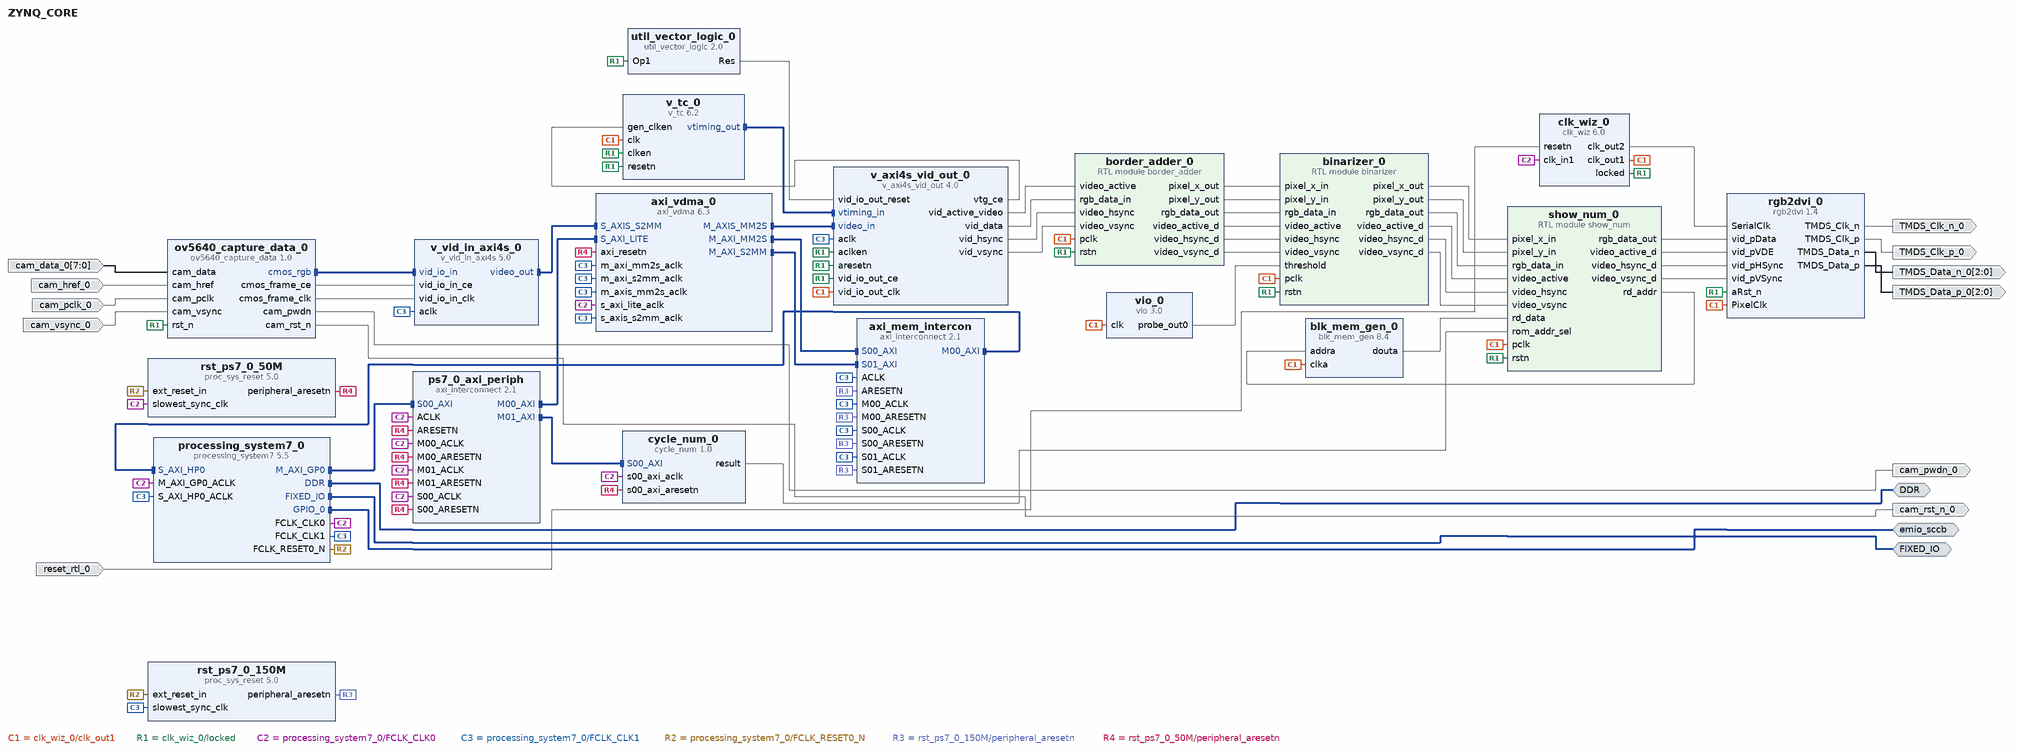
[diagram p0: block diagram of the top level]
# Vivado block design ZYNQ_CORE, xc7z020clg484-1, Vivado 2023.1
create_bd_design ZYNQ_CORE

create_bd_intf_port -mode Master -vlnv xilinx.com:interface:ddrx_rtl:1.0 DDR
create_bd_intf_port -mode Master -vlnv xilinx.com:display_processing_system7:fixedio_rtl:1.0 FIXED_IO
create_bd_intf_port -mode Master -vlnv xilinx.com:interface:gpio_rtl:1.0 emio_sccb
create_bd_port -dir I -type rst reset_rtl_0
set_property -dict {CONFIG.POLARITY ACTIVE_LOW} [get_bd_ports reset_rtl_0]
create_bd_port -dir O -type clk TMDS_Clk_p_0
create_bd_port -dir O -type clk TMDS_Clk_n_0
create_bd_port -dir O -from 2 -to 0 TMDS_Data_p_0
create_bd_port -dir O -from 2 -to 0 TMDS_Data_n_0
create_bd_port -dir I -from 7 -to 0 cam_data_0
create_bd_port -dir I cam_href_0
create_bd_port -dir I cam_vsync_0
create_bd_port -dir I cam_pclk_0
create_bd_port -dir O -type rst cam_rst_n_0
create_bd_port -dir O cam_pwdn_0

create_bd_cell -type ip -vlnv xilinx.com:ip:processing_system7:5.5 processing_system7_0
set_property -dict [list \
  CONFIG.PCW_EN_CLK1_PORT 1 \
  CONFIG.PCW_FCLK_CLK1_BUF TRUE \
  CONFIG.PCW_FPGA1_PERIPHERAL_FREQMHZ 150 \
  CONFIG.PCW_FPGA_FCLK1_ENABLE 1 \
  CONFIG.PCW_GPIO_EMIO_GPIO_ENABLE 1 \
  CONFIG.PCW_GPIO_EMIO_GPIO_IO 2 \
  CONFIG.PCW_GPIO_EMIO_GPIO_WIDTH 2 \
  CONFIG.PCW_SD0_GRP_CD_ENABLE 0 \
  CONFIG.PCW_SD0_GRP_WP_ENABLE 0 \
  CONFIG.PCW_SD0_PERIPHERAL_ENABLE 1 \
  CONFIG.PCW_SD0_SD0_IO {MIO 40 .. 45} \
  CONFIG.PCW_SDIO_PERIPHERAL_FREQMHZ 100 \
  CONFIG.PCW_UIPARAM_DDR_BUS_WIDTH {16 Bit} \
  CONFIG.PCW_UIPARAM_DDR_PARTNO {MT41K256M16 RE-125} \
  CONFIG.PCW_USE_S_AXI_HP0 1 \
] [get_bd_cells processing_system7_0]
# 55 more settings of processing_system7_0 are not shown: defaults, MIO pin electricals, DDR timing, and values the tool derives
create_bd_cell -type ip -vlnv xilinx.com:ip:axi_vdma:6.3 axi_vdma_0
set_property -dict [list \
  CONFIG.c_m_axis_mm2s_tdata_width 24 \
  CONFIG.c_mm2s_linebuffer_depth 2048 \
  CONFIG.c_mm2s_max_burst_length 64 \
  CONFIG.c_s2mm_linebuffer_depth 2048 \
  CONFIG.c_s2mm_max_burst_length 64 \
] [get_bd_cells axi_vdma_0]
create_bd_cell -type ip -vlnv xilinx.com:ip:v_axi4s_vid_out:4.0 v_axi4s_vid_out_0
set_property -dict {CONFIG.C_HAS_ASYNC_CLK 1} [get_bd_cells v_axi4s_vid_out_0]
create_bd_cell -type ip -vlnv xilinx.com:ip:v_tc:6.2 v_tc_0
set_property -dict {CONFIG.HAS_AXI4_LITE false CONFIG.VIDEO_MODE 720p CONFIG.enable_detection false} [get_bd_cells v_tc_0]
create_bd_cell -type ip -vlnv xilinx.com:ip:clk_wiz:6.0 clk_wiz_0
set_property -dict [list \
  CONFIG.CLKIN1_JITTER_PS 200.0 \
  CONFIG.CLKOUT1_JITTER 155.608 \
  CONFIG.CLKOUT1_PHASE_ERROR 158.235 \
  CONFIG.CLKOUT1_REQUESTED_OUT_FREQ 75 \
  CONFIG.CLKOUT2_JITTER 117.790 \
  CONFIG.CLKOUT2_PHASE_ERROR 158.235 \
  CONFIG.CLKOUT2_REQUESTED_OUT_FREQ 375 \
  CONFIG.CLKOUT2_USED true \
  CONFIG.MMCM_CLKFBOUT_MULT_F 22.500 \
  CONFIG.MMCM_CLKIN1_PERIOD 20.000 \
  CONFIG.MMCM_CLKIN2_PERIOD 10.0 \
  CONFIG.MMCM_CLKOUT0_DIVIDE_F 15.000 \
  CONFIG.MMCM_CLKOUT1_DIVIDE 3 \
  CONFIG.NUM_OUT_CLKS 2 \
  CONFIG.PRIM_IN_FREQ 50 \
  CONFIG.RESET_PORT resetn \
  CONFIG.RESET_TYPE ACTIVE_LOW \
] [get_bd_cells clk_wiz_0]
create_bd_cell -type ip -vlnv xilinx.com:ip:axi_interconnect:2.1 ps7_0_axi_periph
set_property -dict {CONFIG.NUM_MI 2} [get_bd_cells ps7_0_axi_periph]
create_bd_cell -type ip -vlnv xilinx.com:ip:proc_sys_reset:5.0 rst_ps7_0_50M
create_bd_cell -type ip -vlnv xilinx.com:ip:axi_interconnect:2.1 axi_mem_intercon
set_property -dict {CONFIG.NUM_MI 1 CONFIG.NUM_SI 2} [get_bd_cells axi_mem_intercon]
create_bd_cell -type ip -vlnv xilinx.com:ip:proc_sys_reset:5.0 rst_ps7_0_150M
create_bd_cell -type ip -vlnv xilinx.com:ip:util_vector_logic:2.0 util_vector_logic_0
set_property -dict {CONFIG.C_OPERATION not CONFIG.C_SIZE 1} [get_bd_cells util_vector_logic_0]
create_bd_cell -type ip -vlnv digilentinc.com:ip:rgb2dvi:1.4 rgb2dvi_0
set_property -dict {CONFIG.kGenerateSerialClk false CONFIG.kRstActiveHigh false} [get_bd_cells rgb2dvi_0]
create_bd_cell -type ip -vlnv xilinx.com:ip:v_vid_in_axi4s:5.0 v_vid_in_axi4s_0
set_property -dict {CONFIG.C_HAS_ASYNC_CLK 1} [get_bd_cells v_vid_in_axi4s_0]
create_bd_cell -type ip -vlnv alientek.com:user:ov5640_capture_data:1.0 ov5640_capture_data_0
create_bd_cell -type ip -vlnv xilinx.com:ip:blk_mem_gen:8.4 blk_mem_gen_0
set_property -dict [list \
  CONFIG.Coe_File ../../../../../../../OV5640_HDMI_ROM_READ_0to9/coe/number.coe \
  CONFIG.Enable_A Always_Enabled \
  CONFIG.Load_Init_File true \
  CONFIG.Memory_Type Single_Port_ROM \
  CONFIG.Register_PortA_Output_of_Memory_Primitives false \
  CONFIG.Write_Depth_A 100000 \
  CONFIG.Write_Width_A 1 \
  CONFIG.use_bram_block Stand_Alone \
] [get_bd_cells blk_mem_gen_0]
create_bd_cell -type module -reference show_num show_num_0
create_bd_cell -type ip -vlnv xilinx.com:user:cycle_num:1.0 cycle_num_0
create_bd_cell -type module -reference border_adder border_adder_0
create_bd_cell -type module -reference binarizer binarizer_0
create_bd_cell -type ip -vlnv xilinx.com:ip:vio:3.0 vio_0
set_property -dict {CONFIG.C_NUM_PROBE_IN 0 CONFIG.C_PROBE_OUT0_INIT_VAL 0x7f CONFIG.C_PROBE_OUT0_WIDTH 8} [get_bd_cells vio_0]

# ---- connections ----

connect_bd_intf_net [get_bd_intf_pins axi_mem_intercon/M00_AXI] [get_bd_intf_pins processing_system7_0/S_AXI_HP0]
connect_bd_intf_net [get_bd_intf_pins axi_vdma_0/M_AXIS_MM2S] [get_bd_intf_pins v_axi4s_vid_out_0/video_in]
connect_bd_intf_net [get_bd_intf_pins axi_vdma_0/M_AXI_MM2S] [get_bd_intf_pins axi_mem_intercon/S00_AXI]
connect_bd_intf_net [get_bd_intf_pins axi_vdma_0/M_AXI_S2MM] [get_bd_intf_pins axi_mem_intercon/S01_AXI]
connect_bd_intf_net [get_bd_intf_pins ov5640_capture_data_0/cmos_rgb] [get_bd_intf_pins v_vid_in_axi4s_0/vid_io_in]
connect_bd_intf_net [get_bd_intf_ports DDR] [get_bd_intf_pins processing_system7_0/DDR]
connect_bd_intf_net [get_bd_intf_ports FIXED_IO] [get_bd_intf_pins processing_system7_0/FIXED_IO]
connect_bd_intf_net [get_bd_intf_ports emio_sccb] [get_bd_intf_pins processing_system7_0/GPIO_0]
connect_bd_intf_net [get_bd_intf_pins processing_system7_0/M_AXI_GP0] [get_bd_intf_pins ps7_0_axi_periph/S00_AXI]
connect_bd_intf_net [get_bd_intf_pins ps7_0_axi_periph/M00_AXI] [get_bd_intf_pins axi_vdma_0/S_AXI_LITE]
connect_bd_intf_net [get_bd_intf_pins ps7_0_axi_periph/M01_AXI] [get_bd_intf_pins cycle_num_0/S00_AXI]
connect_bd_intf_net [get_bd_intf_pins v_tc_0/vtiming_out] [get_bd_intf_pins v_axi4s_vid_out_0/vtiming_in]
connect_bd_intf_net [get_bd_intf_pins v_vid_in_axi4s_0/video_out] [get_bd_intf_pins axi_vdma_0/S_AXIS_S2MM]
connect_bd_net [get_bd_pins binarizer_0/pixel_x_out] [get_bd_pins show_num_0/pixel_x_in]
connect_bd_net [get_bd_pins binarizer_0/pixel_y_out] [get_bd_pins show_num_0/pixel_y_in]
connect_bd_net [get_bd_pins binarizer_0/rgb_data_out] [get_bd_pins show_num_0/rgb_data_in]
connect_bd_net [get_bd_pins binarizer_0/video_active_d] [get_bd_pins show_num_0/video_active]
connect_bd_net [get_bd_pins binarizer_0/video_hsync_d] [get_bd_pins show_num_0/video_hsync]
connect_bd_net [get_bd_pins binarizer_0/video_vsync_d] [get_bd_pins show_num_0/video_vsync]
connect_bd_net [get_bd_pins blk_mem_gen_0/douta] [get_bd_pins show_num_0/rd_data]
connect_bd_net [get_bd_pins border_adder_0/pixel_x_out] [get_bd_pins binarizer_0/pixel_x_in]
connect_bd_net [get_bd_pins border_adder_0/pixel_y_out] [get_bd_pins binarizer_0/pixel_y_in]
connect_bd_net [get_bd_pins border_adder_0/rgb_data_out] [get_bd_pins binarizer_0/rgb_data_in]
connect_bd_net [get_bd_pins border_adder_0/video_active_d] [get_bd_pins binarizer_0/video_active]
connect_bd_net [get_bd_pins border_adder_0/video_hsync_d] [get_bd_pins binarizer_0/video_hsync]
connect_bd_net [get_bd_pins border_adder_0/video_vsync_d] [get_bd_pins binarizer_0/video_vsync]
connect_bd_net -net cam_data_0_1 [get_bd_ports cam_data_0] [get_bd_pins ov5640_capture_data_0/cam_data]
connect_bd_net -net cam_href_0_1 [get_bd_ports cam_href_0] [get_bd_pins ov5640_capture_data_0/cam_href]
connect_bd_net -net cam_pclk_0_1 [get_bd_ports cam_pclk_0] [get_bd_pins ov5640_capture_data_0/cam_pclk]
connect_bd_net -net cam_vsync_0_1 [get_bd_ports cam_vsync_0] [get_bd_pins ov5640_capture_data_0/cam_vsync]
connect_bd_net [get_bd_pins clk_wiz_0/clk_out1] \
  [get_bd_pins v_tc_0/clk] [get_bd_pins v_axi4s_vid_out_0/vid_io_out_clk] [get_bd_pins rgb2dvi_0/PixelClk] \
  [get_bd_pins blk_mem_gen_0/clka] [get_bd_pins show_num_0/pclk] [get_bd_pins border_adder_0/pclk] \
  [get_bd_pins binarizer_0/pclk] [get_bd_pins vio_0/clk]
connect_bd_net [get_bd_pins clk_wiz_0/clk_out2] [get_bd_pins rgb2dvi_0/SerialClk]
connect_bd_net [get_bd_pins clk_wiz_0/locked] \
  [get_bd_pins v_tc_0/clken] [get_bd_pins v_tc_0/resetn] [get_bd_pins v_axi4s_vid_out_0/vid_io_out_ce] \
  [get_bd_pins v_axi4s_vid_out_0/aresetn] [get_bd_pins v_axi4s_vid_out_0/aclken] [get_bd_pins util_vector_logic_0/Op1] \
  [get_bd_pins rgb2dvi_0/aRst_n] [get_bd_pins ov5640_capture_data_0/rst_n] [get_bd_pins show_num_0/rstn] \
  [get_bd_pins border_adder_0/rstn] [get_bd_pins binarizer_0/rstn]
connect_bd_net [get_bd_pins cycle_num_0/result] [get_bd_pins show_num_0/rom_addr_sel]
connect_bd_net [get_bd_pins ov5640_capture_data_0/cam_pwdn] [get_bd_ports cam_pwdn_0]
connect_bd_net [get_bd_pins ov5640_capture_data_0/cam_rst_n] [get_bd_ports cam_rst_n_0]
connect_bd_net [get_bd_pins ov5640_capture_data_0/cmos_frame_ce] [get_bd_pins v_vid_in_axi4s_0/vid_io_in_ce]
connect_bd_net [get_bd_pins ov5640_capture_data_0/cmos_frame_clk] [get_bd_pins v_vid_in_axi4s_0/vid_io_in_clk]
connect_bd_net [get_bd_pins processing_system7_0/FCLK_CLK0] \
  [get_bd_pins clk_wiz_0/clk_in1] [get_bd_pins processing_system7_0/M_AXI_GP0_ACLK] [get_bd_pins axi_vdma_0/s_axi_lite_aclk] \
  [get_bd_pins ps7_0_axi_periph/ACLK] [get_bd_pins ps7_0_axi_periph/S00_ACLK] [get_bd_pins rst_ps7_0_50M/slowest_sync_clk] \
  [get_bd_pins ps7_0_axi_periph/M00_ACLK] [get_bd_pins cycle_num_0/s00_axi_aclk] [get_bd_pins ps7_0_axi_periph/M01_ACLK]
connect_bd_net [get_bd_pins processing_system7_0/FCLK_CLK1] \
  [get_bd_pins processing_system7_0/S_AXI_HP0_ACLK] [get_bd_pins axi_vdma_0/m_axi_mm2s_aclk] \
  [get_bd_pins axi_vdma_0/s_axis_s2mm_aclk] [get_bd_pins axi_vdma_0/m_axis_mm2s_aclk] \
  [get_bd_pins axi_vdma_0/m_axi_s2mm_aclk] [get_bd_pins v_axi4s_vid_out_0/aclk] [get_bd_pins axi_mem_intercon/ACLK] \
  [get_bd_pins axi_mem_intercon/S00_ACLK] [get_bd_pins rst_ps7_0_150M/slowest_sync_clk] \
  [get_bd_pins axi_mem_intercon/M00_ACLK] [get_bd_pins axi_mem_intercon/S01_ACLK] [get_bd_pins v_vid_in_axi4s_0/aclk]
connect_bd_net [get_bd_pins processing_system7_0/FCLK_RESET0_N] [get_bd_pins rst_ps7_0_50M/ext_reset_in] [get_bd_pins rst_ps7_0_150M/ext_reset_in]
connect_bd_net -net reset_rtl_0_1 [get_bd_ports reset_rtl_0] [get_bd_pins clk_wiz_0/resetn]
connect_bd_net [get_bd_pins rgb2dvi_0/TMDS_Clk_n] [get_bd_ports TMDS_Clk_n_0]
connect_bd_net [get_bd_pins rgb2dvi_0/TMDS_Clk_p] [get_bd_ports TMDS_Clk_p_0]
connect_bd_net [get_bd_pins rgb2dvi_0/TMDS_Data_n] [get_bd_ports TMDS_Data_n_0]
connect_bd_net [get_bd_pins rgb2dvi_0/TMDS_Data_p] [get_bd_ports TMDS_Data_p_0]
connect_bd_net [get_bd_pins rst_ps7_0_150M/peripheral_aresetn] \
  [get_bd_pins axi_mem_intercon/S00_ARESETN] [get_bd_pins axi_mem_intercon/M00_ARESETN] \
  [get_bd_pins axi_mem_intercon/ARESETN] [get_bd_pins axi_mem_intercon/S01_ARESETN]
connect_bd_net [get_bd_pins rst_ps7_0_50M/peripheral_aresetn] \
  [get_bd_pins ps7_0_axi_periph/S00_ARESETN] [get_bd_pins axi_vdma_0/axi_resetn] [get_bd_pins ps7_0_axi_periph/M00_ARESETN] \
  [get_bd_pins ps7_0_axi_periph/ARESETN] [get_bd_pins cycle_num_0/s00_axi_aresetn] [get_bd_pins ps7_0_axi_periph/M01_ARESETN]
connect_bd_net [get_bd_pins show_num_0/rd_addr] [get_bd_pins blk_mem_gen_0/addra]
connect_bd_net [get_bd_pins show_num_0/rgb_data_out] [get_bd_pins rgb2dvi_0/vid_pData]
connect_bd_net [get_bd_pins show_num_0/video_active_d] [get_bd_pins rgb2dvi_0/vid_pVDE]
connect_bd_net [get_bd_pins show_num_0/video_hsync_d] [get_bd_pins rgb2dvi_0/vid_pHSync]
connect_bd_net [get_bd_pins show_num_0/video_vsync_d] [get_bd_pins rgb2dvi_0/vid_pVSync]
connect_bd_net [get_bd_pins util_vector_logic_0/Res] [get_bd_pins v_axi4s_vid_out_0/vid_io_out_reset]
connect_bd_net [get_bd_pins v_axi4s_vid_out_0/vid_active_video] [get_bd_pins border_adder_0/video_active]
connect_bd_net [get_bd_pins v_axi4s_vid_out_0/vid_data] [get_bd_pins border_adder_0/rgb_data_in]
connect_bd_net [get_bd_pins v_axi4s_vid_out_0/vid_hsync] [get_bd_pins border_adder_0/video_hsync]
connect_bd_net [get_bd_pins v_axi4s_vid_out_0/vid_vsync] [get_bd_pins border_adder_0/video_vsync]
connect_bd_net [get_bd_pins v_axi4s_vid_out_0/vtg_ce] [get_bd_pins v_tc_0/gen_clken]
connect_bd_net [get_bd_pins vio_0/probe_out0] [get_bd_pins binarizer_0/threshold]

# ---- address map ----
assign_bd_address -offset 0x00000000 -range 512M -target_address_space [get_bd_addr_spaces axi_vdma_0/Data_MM2S] [get_bd_addr_segs processing_system7_0/S_AXI_HP0/HP0_DDR_LOWOCM]
assign_bd_address -offset 0x00000000 -range 512M -target_address_space [get_bd_addr_spaces axi_vdma_0/Data_S2MM] [get_bd_addr_segs processing_system7_0/S_AXI_HP0/HP0_DDR_LOWOCM]
assign_bd_address -offset 0x43000000 -range 64K -target_address_space [get_bd_addr_spaces processing_system7_0/Data] [get_bd_addr_segs axi_vdma_0/S_AXI_LITE/Reg]
assign_bd_address -offset 0x43C00000 -range 64K -target_address_space [get_bd_addr_spaces processing_system7_0/Data] [get_bd_addr_segs cycle_num_0/S00_AXI/S00_AXI_reg]

validate_bd_design
save_bd_design
